# EasyEDA Pro project E-SportsV0.2.epro, board PCB2
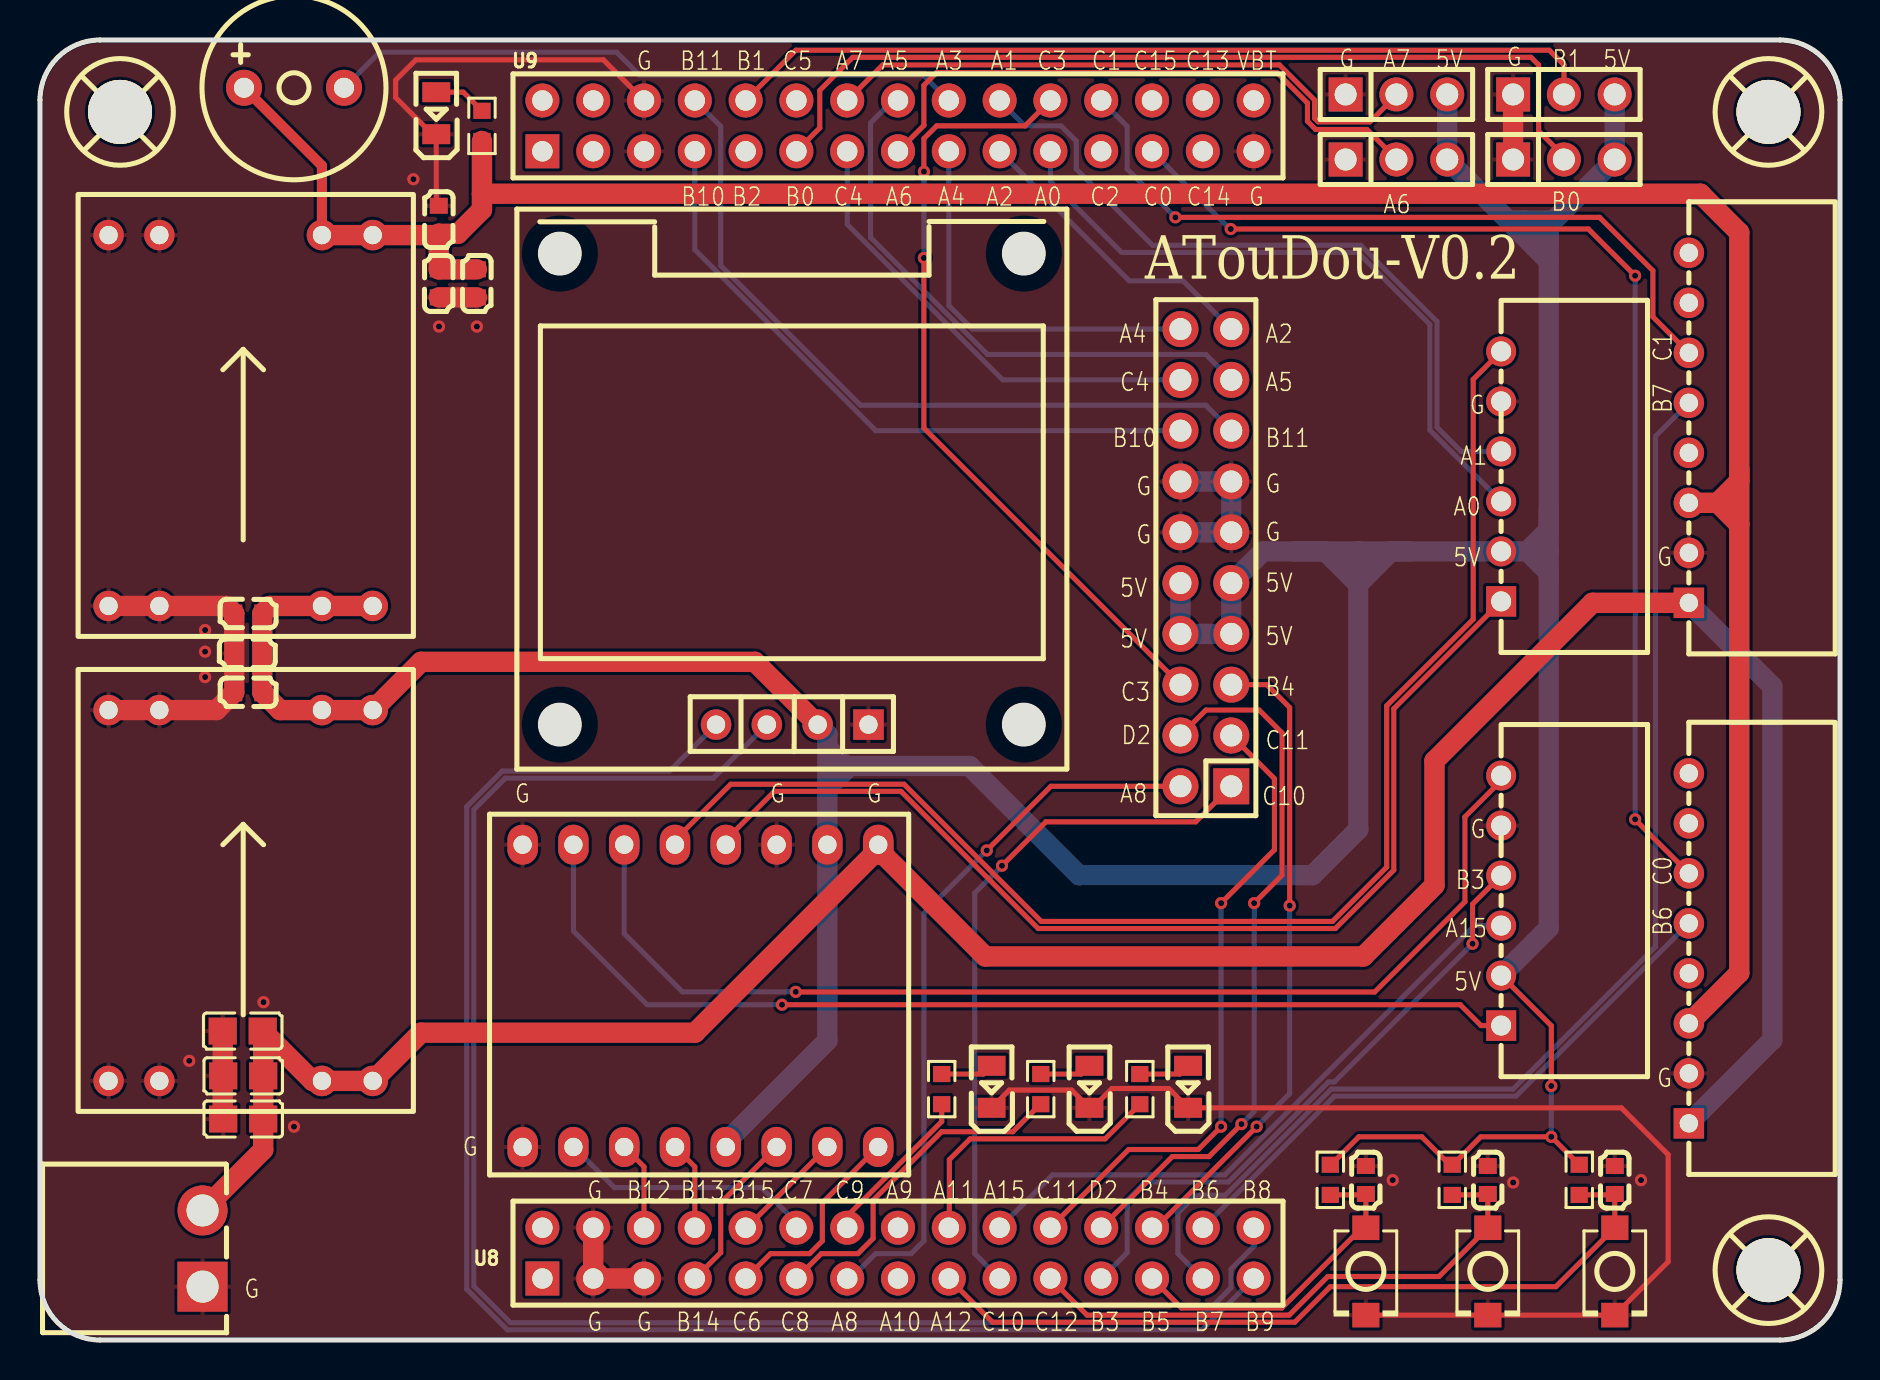
[diagram p5: board, top side]
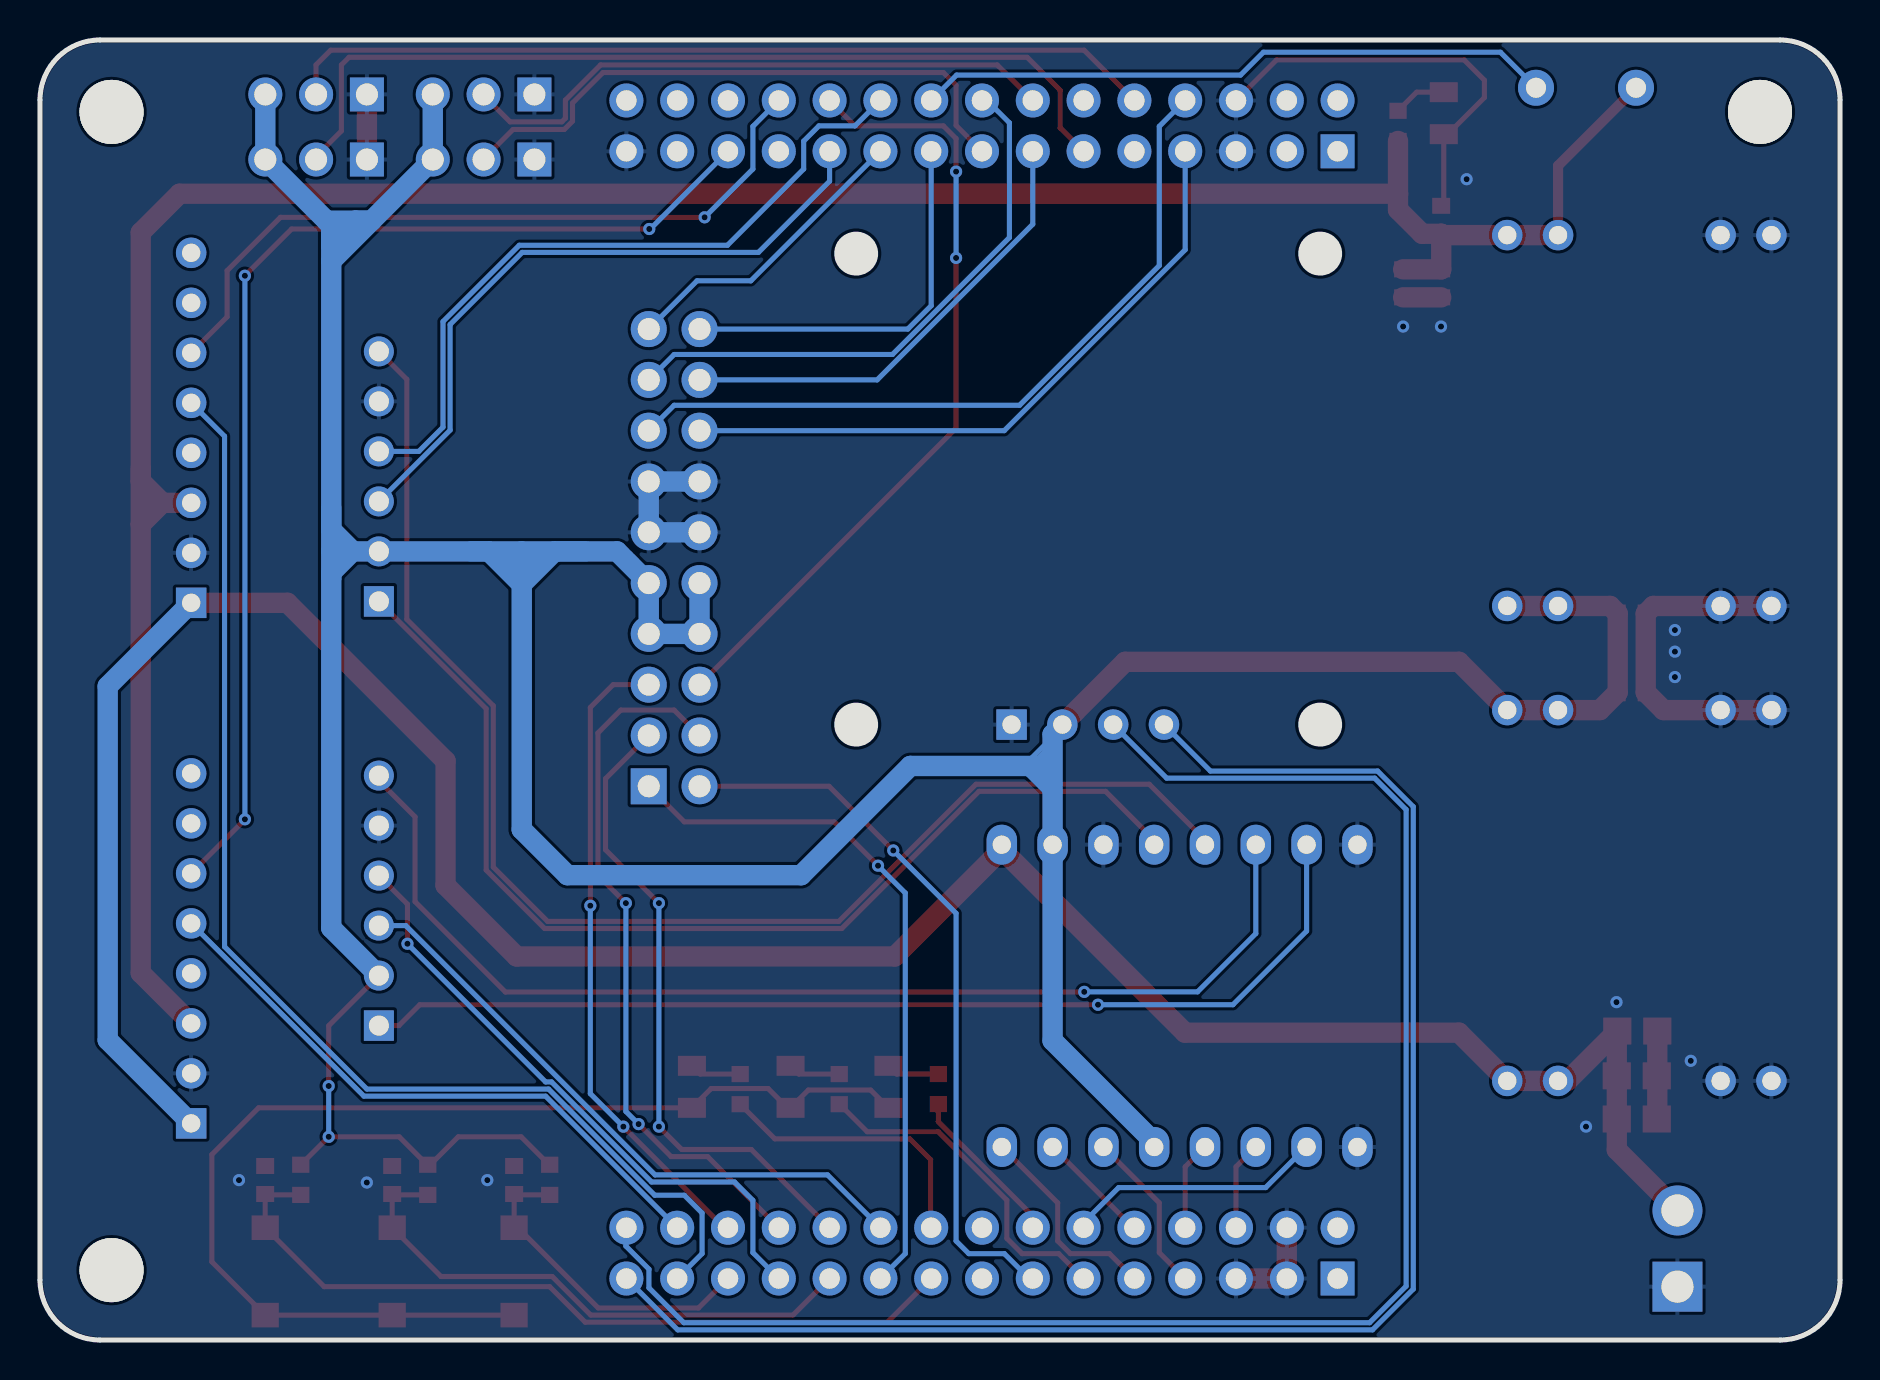
[diagram p6: board, bottom side, seen from below]

Outline 90 x 65 mm; copper layers: Top Layer, Bottom Layer. Coordinates in mm from the lower left corner of the outline.
Outline path: 0,62 0,3 arc(0.88,0.88) 3,0 87,0 arc(89.12,0.88) 90,3 90,62 arc(89.12,64.12) 87,65 3,65 arc(0.88,64.12) 0,62
Stack: Top Layer 0.035mm / Dielectric1 1.51mm FR4 er 4.5 / Bottom Layer 0.035mm

## Design rules (mm)
template: JLCPCB Capability(Two Layers Board)
spacing copperThickness1oz (default): track to track 0.102, other pairs 0.152 to 0.3
spacing copperThickness2oz: track to track 0.203, other pairs 0.152 to 0.3
track width copperThickness1oz (default): min 0.127, default 0.254, max 2.54
track width copperThickness2oz: min 0.203, default 0.254, max 2.54
differential pair differentialPair (default): width min 0.127, default 0.254, max 2.54; gap min 0.152, default 0.152
via viaSize (default): diameter min 0.5, default 0.61, max 10; hole min 0.3, default 0.305, max 6.3

## Placement (name value [footprint] x y rotation side)
BUZZER1  3kHz  [BUZ-TH_BD9.0-P5.00-D0.6-FD]  12.7 62.61 0 top
C13  10uF  [C0805]  10.16 11.05 0 top
C14  10uF  [C0805]  10.16 13.21 0 top
C15  10uF  [C0805]  10.14 15.45 0 top
C16  100nF  [C0603]  19.94 52.83 90 top
C17  100nF  [C0603]  21.84 52.83 90 top
C18  100nF  [C0603]  19.94 56.01 270 top
C19  100nF  [C0603]  10.41 36.32 0 top
C20  100nF  [C0603]  10.37 34.33 0 top
C21  100nF  [C0603]  10.41 32.39 0 top
C27  100nF  [C0603]  78.74 8 90 top
C28  100nF  [C0603]  72.39 8 90 top
C29  100nF  [C0603]  66.29 8 90 top
CN4  DB2ERC-3.81-2P-GN  [CONN-TH_2P-P3.81_DB2ERC-3.81-2P]  8.13 4.57 270 top
H1  PZ254V-11-03P  [HDR-TH_3P-P2.54-V-M]  76.19 62.28 0 top
H2  PZ254V-11-03P  [HDR-TH_3P-P2.54-V-M]  76.19 59.02 0 top
H3  PZ254V-11-03P  [HDR-TH_3P-P2.54-V-M]  67.82 62.28 0 top
H4  PZ254V-11-03P  [HDR-TH_3P-P2.54-V-M]  67.82 59.02 0 top
LED1  KT-0805W  [LED0805-R-RD]  19.81 61.34 90 top
LED2  KT-0805白灯  [LED0805-R-RD]  52.47 12.66 90 top
LED3  KT-0805白灯  [LED0805-R-RD]  57.4 12.66 90 top
LED4  KT-0805白灯  [LED0805-R-RD]  47.58 12.66 90 top
OLED1  0.96OLED_4P_MODULE_JX  [0.96OLED_4P]  37.59 42.55 180 top
R1  1K  [R0603]  45.09 12.54 90 top
R2  1K  [R0603]  50.04 12.54 90 top
R3  1K  [R0603]  54.99 12.54 90 top
R4  1K  [R0603]  22.1 60.71 90 top
R5  10K  [R0603]  76.96 8.01 270 top
R6  10K  [R0603]  70.61 8.01 270 top
R7  10K  [R0603]  64.52 8.01 270 top
SCREW1  -  [M3螺丝]  4.06 61.34 0 top
SCREW2  -  [M3螺丝]  86.49 61.34 0 top
SCREW3  -  [M3螺丝]  86.49 3.43 0 top
SW1  TS-1088-AR02016  [SW-SMD_L3.9-W3.0-P4.45]  78.74 3.43 270 top
SW2  TS-1088-AR02016  [SW-SMD_L3.9-W3.0-P4.45]  72.39 3.43 270 top
SW3  TS-1088-AR02016  [SW-SMD_L3.9-W3.0-P4.45]  66.29 3.43 270 top
U8  PM254-2-15-Z-8.5  [HDR-TH_30P-P2.54-V-F-R2-C15-S2.54-2]  42.9 4.34 0 top
U9  PM254-2-15-Z-8.5  [HDR-TH_30P-P2.54-V-F-R2-C15-S2.54-2]  42.9 60.71 0 top
U11  -  [MP1584模块]  3.43 12.95 90 top
U12  -  [MP1584模块]  3.43 36.7 90 top
U13  -  [TB6612]  33.4 17.14 270 top
U14  ZX-XH2.54-6PWZ  [CONN-TH_6P-P2.50_ZX-XH2.54-6PWZ]  73.06 43.18 90 top
U15  ZX-XH2.54-6PWZ  [CONN-TH_6P-P2.50_ZX-XH2.54-6PWZ]  73.06 21.97 90 top
U16  ZX-XH2.54-8PWZ  [CONN-TH_8P-P2.50_ZX-XH2.54-8PWZ]  82.44 19.58 90 top
U17  ZX-XH2.54-8PWZ  [CONN-TH_8P-P2.50_ZX-XH2.54-8PWZ]  82.44 45.61 90 top
U18  PM254-2-10-Z-8.5  [HDR-TH_20P-P2.54-V-F-R2-C10-S2.54]  58.29 39.12 90 top

## Footprints (pads in the part's own frame, mm; a bottom-side part is the same pattern mirrored in y, then rotated)
0.96OLED_4P
  rect 1.524x1.524 hole 0.914: 1(-3.83,11.775)
  round 1.524 hole 0.914: 2(-1.29,11.775) 3(1.25,11.775) 4(3.789,11.775)
BUZ-TH_BD9.0-P5.00-D0.6-FD
  round 1.8 hole 1: 1(-2.5,0) 2(2.5,0)
C0603
  rect 0.8x0.9 smd: 1(-0.7,0) 2(0.7,0)
C0805
  rect 1.41x1.35 smd: 1(-1,0) 2(1,0)
CONN-TH_2P-P3.81_DB2ERC-3.81-2P
  rect 2.5x2.5 hole 1.6: 1(1.905,0)
  round 2.5 hole 1.6: 2(-1.905,0)
CONN-TH_6P-P2.50_ZX-XH2.54-6PWZ
  rect 1.524x1.5 hole 1: 1(-6.25,0)
  round 1.5 hole 1: 2(-3.75,0) 3(-1.25,0) 4(1.25,0) 5(3.75,0) 6(6.25,0)
CONN-TH_8P-P2.50_ZX-XH2.54-8PWZ
  rect 1.524x1.524 hole 0.914: 1(-8.75,0)
  round 1.524 hole 0.914: 2(-6.25,0) 3(-3.75,0) 4(-1.25,0) 5(1.25,0) 6(3.75,0) 7(6.25,0) 8(8.75,0)
HDR-TH_3P-P2.54-V-M
  rect 1.7x1.7 hole 1.1: 1(-2.54,0)
  round 1.7 hole 1.1: 2(0,0) 3(2.54,0)
HDR-TH_20P-P2.54-V-F-R2-C10-S2.54
  rect 1.8x1.8 hole 1.1: 1(-11.43,-1.27)
  round 1.8 hole 1.1: 2(-11.43,1.27) 3(-8.89,-1.27) 4(-8.89,1.27) 5(-6.35,-1.27) 6(-6.35,1.27) 7(-3.81,-1.27) 8(-3.81,1.27) 9(-1.27,-1.27) 10(-1.27,1.27) 11(1.27,-1.27) 12(1.27,1.27) 13(3.81,-1.27) 14(3.81,1.27) 15(6.35,-1.27) 16(6.35,1.27) 17(8.89,-1.27) 18(8.89,1.27) 19(11.43,-1.27) 20(11.43,1.27)
HDR-TH_30P-P2.54-V-F-R2-C15-S2.54-2
  rect 1.7x1.7 hole 1.02: 1(-17.78,-1.27)
  round 1.7 hole 1.02: 2(-17.78,1.27) 3(-15.24,-1.27) 4(-15.24,1.27) 5(-12.7,-1.27) 6(-12.7,1.27) 7(-10.16,-1.27) 8(-10.16,1.27) 9(-7.62,-1.27) 10(-7.62,1.27) 11(-5.08,-1.27) 12(-5.08,1.27) 13(-2.54,-1.27) 14(-2.54,1.27) 15(0,-1.27) 16(0,1.27) 17(2.54,-1.27) 18(2.54,1.27) 19(5.08,-1.27) 20(5.08,1.27) 21(7.62,-1.27) 22(7.62,1.27) 23(10.16,-1.27) 24(10.16,1.27) 25(12.7,-1.27) 26(12.7,1.27) 27(15.24,-1.27) 28(15.24,1.27) 29(17.78,-1.27) 30(17.78,1.27)
LED0805-R-RD
  rect 1x1.399 smd: 1(1.05,0) 2(-1.05,0)
M3螺丝
  round 3.2 hole 3.2: 1(-0.064,0.064)
MP1584模块
  round 1.524 hole 0.914: 1(0,0) 2(0,-2.54) 3(0,-10.668) 4(0,-13.208) 5(18.542,-13.208) 6(18.542,-10.668) 7(18.542,-2.54) 8(18.542,0)
R0603
  rect 0.806x0.864 smd: 1(-0.753,0) 2(0.753,0)
SW-SMD_L3.9-W3.0-P4.45
  rect 1.23x1.36 smd: 1(-2.185,0) 2(2.185,0)
TB6612
  oval 2x1.524 hole 0.914: 1(-7.62,8.509) 2(-7.62,5.969) 3(-7.62,3.429) 4(-7.62,0.889) 5(-7.62,-1.651) 6(-7.62,-4.191) 7(-7.62,-6.731) 8(-7.62,-9.271) 9(7.493,-9.271) 10(7.493,-6.731) 11(7.493,-4.191) 12(7.493,-1.651) 13(7.493,0.889) 14(7.493,3.429) 15(7.493,5.969) 16(7.493,8.509)

## Nets
As in the schematic.

Pads without a net: SCREW1 1; SCREW2 1; SCREW3 1; U8 1 2; U9 1 2 3 4; U16 4 7 8; U17 4 7 8

## Via types
v1: diameter 0.61, hole 0.305, Top Layer to Bottom Layer, 31 vias

## Routing (per net, layer and track width the routed paths; a pad name or vN(x,y) marks a point on that pad's centre or on a via; arc(x,y) is an arc through that point)
3V3: length 134
  Top Layer w0.508: BUZZER1.1 14.1,58.71 14.1,55.25
  Top Layer w1.016: 84.96,40.77 84.96,43.58 ; 84.96,40.77 84.96,18.35 U16.3 ; 84.96,40.77 83.88,41.86 ; 22.1,57.31 83.02,57.31 84.96,55.37 84.96,42.94 83.88,41.86 ; 22.1,57.31 R4.1 ; 22.1,57.31 22.1,56.52 20.89,55.31 C18.2 ; C18.2 C16.2 C17.2 ; C18.2 19.87,55.25 U12.5 14.1,55.25 ; U17.3 83.88,41.86
5V: length 237.2
  Top Layer w0.254: R7.1 64.54,8.76 65.94,10.16 69.09,10.16 70.49,8.76 R6.1 70.64,8.76 72.04,10.16 v1(75.56,10.16) R5.1 ; U15.2 75.56,15.71 v1(75.56,12.7)
  Top Layer w1.016: U12.4 11.5,36.7 C19.2 C21.2 12,31.5 U11.5 19.05,33.91 35.74,33.91 OLED1.2
  Bottom Layer w0.254: 39.62,27.31 40.64,28.32 40.41,28.32 39.88,27.79 39.88,28.2 40.13,28.45 40.13,28.07 40,27.94 ; 40.47,28.7 40.32,28.7 40.47,28.7 ; 40.47,28.7 40.39,28.78 40.39,28.96 40.21,28.96 39.37,29.8 39.72,29.8 40.82,28.7 40.47,28.7 ; v1(75.56,10.16) v1(75.56,12.7)
  Bottom Layer w1.016: 62.74,39.43 64.27,39.43 65.91,37.79 67.56,39.43 68.44,39.43 ; 74.22,55.97 73.42,55.97 74.22,55.97 ; 74.22,55.97 75.62,55.97 75.65,55.94 75.44,55.73 ; 74.22,55.97 74.22,55.92 75.44,54.7 75.44,55.73 ; 74.36,39.43 75.44,40.51 75.44,41.59 ; 74.37,39.43 75.44,38.37 75.44,38.1 ; 75.44,55.73 78.74,59.02 78.74,62.28 ; 75.44,55.73 75.44,53.95 ; 65.91,39.43 65.91,25.53 63.63,23.24 51.94,23.24 46.48,28.7 39.62,28.7 ; 65.91,39.43 U14.2 75.44,39.43 ; 65.91,39.43 61.15,39.43 U18.9 U18.7 U18.8 U18.10 ; U15.2 75.44,20.6 75.44,39.43 ; U13.13 34.29,9.89 39.37,14.97 U13.2 39.37,30.28 OLED1.2 ; 75.44,53.95 H4.3 H3.3 ; 75.44,53.95 75.44,39.43
12V: length 130.2
  Top Layer w1.016: 11.16,15.42 C14.2 C13.2 11.16,9.51 CN4.2 ; 11.16,15.42 13.63,12.95 U11.4 19.05,15.37 32.75,15.37 41.91,24.53 ; 11.16,15.42 C15.2 ; 41.91,24.53 47.26,19.18 66.17,19.18 69.72,22.73 69.72,28.96 77.63,36.86 U17.1 ; 41.91,24.53 U13.1
  Bottom Layer w1.016: U17.1 86.61,32.69 86.61,15 U16.1
GND: length 118.2
  Top Layer w0.254: SW3.2 SW2.2 SW1.2 81.41,3.91 81.41,9.27 79.07,11.61 57.4,11.61 56.44,12.57 53.59,12.57 52.63,11.61 52.47,11.61 51.58,12.5 48.47,12.5 47.58,11.61 ; U9.6 28.17,64.01 18.8,64.01 17.78,62.99 17.78,62.12 19.61,60.29 LED1.2 19.81,56.84 19.88,56.77
  Top Layer w0.305: C18.1 19.88,56.77
  Top Layer w1.016: U8.4 U8.3 U8.5 ; C15.1 9.14,13.18 ; 9.14,13.18 9.14,11.07 C13.1 ; 9.14,13.18 C14.1 ; C16.1 C17.1 ; H1.1 H2.1 ; U12.1 9.33,36.7 C19.1 C21.1 8.83,31.5 U11.8
  Bottom Layer w1.016: U18.12 U18.11 U18.13 U18.14
  vias: v1(7.46,13.96) v1(8.25,35.5) v1(8.25,34.42) v1(8.25,33.15) v1(11.18,16.89) v1(12.7,10.67) v1(18.67,58.04) v1(19.95,50.67) v1(21.84,50.67) v1(67.63,7.99) v1(73.66,7.87) v1(80.05,7.99)
AO1: length 54.4
  Top Layer w0.254: U13.4 34.29,25 36.72,27.43 43.05,27.43 49.91,20.57 64.77,20.57 67.69,23.5 67.69,31.56 U14.1
AO2: length 69.1
  Top Layer w0.254: U14.6 71.66,48.03 71.66,36.04 67.34,31.71 67.34,23.64 64.62,20.93 50.06,20.93 43.2,27.79 34.53,27.79 31.75,25 U13.5
BO1: length 52.7
  Top Layer w0.254: U15.1 72.05,15.72 71.01,16.76 v1(37.1,16.76)
  Bottom Layer w0.254: U13.7 26.67,20.45 30.35,16.76 v1(37.1,16.76)
BO2: length 56.6
  Top Layer w0.254: v1(37.79,17.41) 37.8,17.4 66.73,17.4 71.25,21.92 71.25,26.16 73.06,27.97 U15.6
  Bottom Layer w0.254: U13.6 29.21,20.32 32.12,17.41 v1(37.79,17.41)
PA0: length 33.8
  Bottom Layer w0.254: U14.3 69.49,45.49 69.49,50.78 65.89,54.38 54.08,54.38 50.52,57.94 U9.21
PA1: length 36.3
  Bottom Layer w0.254: U14.4 71.06,44.43 69.85,45.64 69.85,50.92 66.04,54.74 55.63,54.74 51.82,58.55 51.82,59.94 51.05,60.71 49.25,60.71 U9.20
PA2: length 15.3
  Bottom Layer w0.254: U18.19 57.15,52.96 54.46,52.96 U9.19
PA3: length 32
  Bottom Layer w0.254: U9.18 44.17,63.25 29.97,63.25 28.83,64.39 16.98,64.39 BUZZER1.2
PA4: length 19.8
  Bottom Layer w0.254: U9.17 45.44,51.71 46.61,50.55 U18.20
PA5: length 28.6
  Bottom Layer w0.254: U9.16 42.65,61.98 41.53,60.86 41.53,55.12 47.38,49.28 58.29,49.28 U18.17
PA6: length 30.1
  Top Layer w0.254: H4.2 67.82,59.05 66.35,60.53 63.79,60.53 63.37,60.94 63.37,61.85 61.85,63.37 44.83,63.37 44.2,62.74 44.2,60.73 U9.15
PA7: length 30.5
  Top Layer w0.254: U9.14 42.14,63.75 61.97,63.75 63.73,62 63.73,61.09 63.91,60.91 66.5,60.91 67.82,62.23 H3.2
PA8: length 36.5
  Top Layer w0.254: v1(47.34,24.48) 50.55,27.69 U18.2
  Bottom Layer w0.254: v1(47.34,24.48) 44.2,21.34 44.2,4.95 43.56,4.32 41.78,4.32 40.54,3.07 U8.13
PA11: length 14.1
  Top Layer w0.254: 54.99,11.79 53.26,10.06 46.51,10.06 45.47,9.02 45.47,5.64 U8.18
PA12: length 39.6
  Top Layer w0.254: R5.2 78.69,7.26 78.74,7.3 SW1.1 75.79,2.67 64.52,2.67 62.74,0.89 47.63,0.89 U8.17
PA15: length 31.3
  Bottom Layer w0.254: U8.20 50.62,8.25 59.25,8.25 71.71,20.72 U15.3
PB0: length 45.6
  Top Layer w0.254: H2.2 76.19,59.19 74.93,60.45 74.93,63.75 74.55,64.14 40.64,64.14 38.99,62.48 38.99,60.6 U9.11
PB1: length 43.7
  Top Layer w0.254: U9.10 37.8,64.49 75.46,64.49 76.2,63.75 76.2,62.28 H1.2
PB3: length 31
  Top Layer w0.254: U15.4 71.63,21.79 v1(71.63,19.81)
  Bottom Layer w0.254: U8.23 54.36,4.37 54.36,6.99 55.27,7.9 59.42,7.9 64.42,12.9 64.72,12.9 v1(71.63,19.81)
PB4: length 32.5
  Top Layer w0.254: U8.26 55.97,5.61 55.97,5.81 v1(60.83,10.67) ; U18.5 61.34,32.77 62.48,31.62 ; 62.48,31.62 v1(62.48,21.72)
  Bottom Layer w0.254: v1(62.48,21.72) 62.48,12.32 v1(60.83,10.67)
PB5: length 16.5
  Top Layer w0.254: R7.2 66.25,7.26 66.29,7.3 SW3.1 66.23,5.68 66.17,5.68 62.09,1.6 57.07,1.6 U8.25
PB6: length 30.6
  Bottom Layer w0.254: U8.28 64.72,12.19 73.8,12.19 U16.5
PB7: length 61.1
  Bottom Layer w0.254: U8.27 56.9,4.32 56.9,6.35 57.78,7.24 59.26,7.24 64.57,12.55 73.66,12.55 80.77,19.66 80.77,45.19 U17.5
PB8: length 83.1
  Bottom Layer w0.254: U8.30 60.71,5.59 60.71,4.7 59.55,3.54 59.55,2.61 57.81,0.86 23.52,0.86 21.69,2.69 21.69,26.52 23.27,28.09 33.66,28.09 OLED1.3
PB9: length 79.5
  Bottom Layer w0.254: U8.29 58.11,0.51 23.37,0.51 21.34,2.54 21.34,26.67 23.12,28.45 31.48,28.45 OLED1.4
PB10: length 33
  Bottom Layer w0.254: U9.7 32.74,54.51 41.79,45.47 U18.16
PB11: length 37.7
  Bottom Layer w0.254: U9.8 34.04,60.68 34.04,53.72 41.02,46.74 58.29,46.74 U18.15
PB12: length 4.4
  Top Layer w0.254: U13.11 30.2,8.66 U8.6
PB13: length 4.4
  Top Layer w0.254: U8.8 32.74,8.66 U13.12
PB14: length 8.3
  Top Layer w0.254: U8.7 34.04,4.37 34.04,6.86 U13.14
PB15: length 5.8
  Top Layer w0.254: U8.10 35.33,5.61 U13.15
PC0: length 57.7
  Top Layer w0.254: v1(59.54,55.55) 77.42,55.55 v1(79.76,53.21) ; v1(79.76,26.03) 79.76,26.02 U16.6
  Bottom Layer w0.254: v1(59.54,55.55) 59.49,55.55 U9.25 ; v1(79.76,53.21) v1(79.76,26.03)
PC1: length 37.2
  Top Layer w0.254: U17.6 80.65,51.16 80.65,53.47 77.98,56.13 v1(56.77,56.13)
  Bottom Layer w0.254: U9.24 54.36,60.68 54.36,58.55 v1(56.77,56.13)
PC3: length 39.7
  Top Layer w0.254: U18.6 44.2,45.59 v1(44.2,54.1) ; v1(44.2,58.42) 44.2,60.07 44.83,60.71 49.25,60.71 U9.22
  Bottom Layer w0.254: v1(44.2,58.42) v1(44.2,54.1)
PC4: length 23.5
  Bottom Layer w0.254: U9.13 40.36,55.79 48.14,48.01 U18.18
PC6: length 10.5
  Top Layer w0.254: U8.9 36.52,4.32 38.48,4.32 39.12,4.95 39.12,6.86 U13.16
PC7: length 13
  Bottom Layer w0.254: U8.12 37.82,5.87 36.07,7.62 28.72,7.62 26.69,9.65 U13.10
PC8: length 16.9
  Top Layer w0.254: U8.11 39.06,4.32 40.89,4.32 41.66,5.08 41.66,6.99 45.08,10.41 48.64,10.41 50.02,11.79 50.04,11.79
PC9: length 8.1
  Top Layer w0.254: 45.09,11.79 45.09,10.92 40.36,6.2 U8.14
PC10: length 34.8
  Top Layer w0.254: v1(48.1,23.72) 50.29,25.91 57.78,25.91 U18.1
  Bottom Layer w0.254: v1(48.1,23.72) 46.74,22.35 46.74,4.32 U8.19
PC11: length 32.2
  Top Layer w0.254: U8.22 54.43,9.53 57.91,9.53 v1(59.06,10.67) ; v1(59.06,21.84) 61.72,24.51 61.72,28.07 U18.3
  Bottom Layer w0.254: v1(59.06,10.67) v1(59.06,21.84)
PC12: length 27.9
  Top Layer w0.254: U8.21 52.35,1.25 62.46,1.25 64.39,3.18 69.95,3.18 SW2.1 72.39,7.3 72.34,7.26 R6.2
PD2: length 35.6
  Top Layer w0.254: v1(60.71,21.84) 62.1,23.24 62.1,30.35 60.96,31.5 58.29,31.5 U18.4 ; U8.24 56.62,9.17 58.44,9.17 v1(60.07,10.79)
  Bottom Layer w0.254: v1(60.07,10.79) 60.71,11.43 v1(60.71,21.84)
$1N6555: length 2.7
  Top Layer w0.254: R4.2 21.17,62.39 LED1.1
$1N8963: length 2.7
  Top Layer w0.254: LED4.1 47.17,13.3 R1.2
$1N8970: length 2.6
  Top Layer w0.254: LED2.1 52.06,13.3 R2.2
$1N8971: length 2.6
  Top Layer w0.254: LED3.1 56.99,13.3 R3.2

## Copper pours and planes (outline as drawn; the poured copper is in the pictures)
GND on Top Layer: -5.84,68.83 97.16,68.83 97.16,-8.38 -5.84,-8.38
GND on Bottom Layer: -5.21,67.44 95,67.44 95,-4.19 -5.21,-4.19

## Text on the board
Top Silkscreen Layer: G | B12 | B14 | B11 | B13 | B10 | B15 | B2 | C6 | B1 | C8 | C5 | C7 | B0 | A8 | C4 | C9 | A7 | A10 | A5 | A6 | A9 | A12 | A11 | A3 | A4 | C10 | A15 | A2 | A1 | A0 | C12 | C11 | C3 | D2 | C2 | B3 | C1 | 5V | C15 | B4 | B5 | C0 | C13 | C14 | B6 | B7 | VBT | B8 | B9 | ATouDou-V0.2
